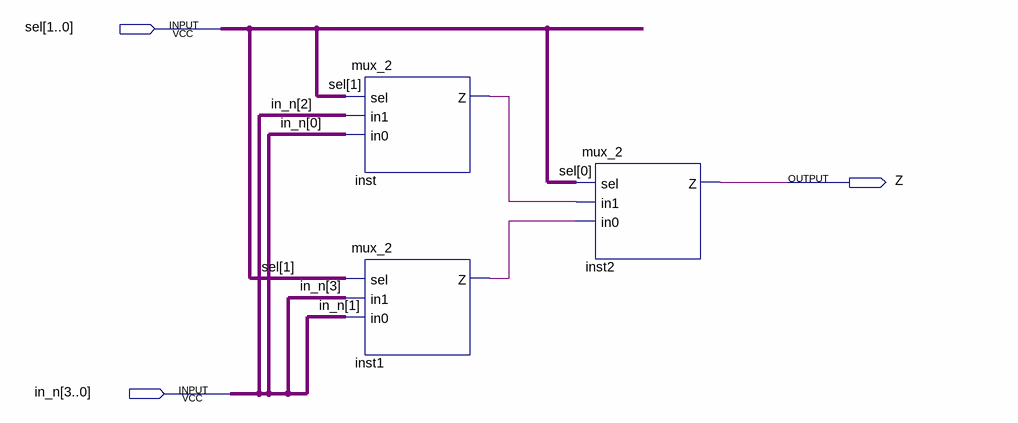
[diagram p0: schematic sheet]
// Quartus schematic mux_n.bdf as structural Verilog: 3 symbols, 3 pins
module mux_n (
  input  [1:0] sel,
  input  [3:0] in_n,
  output Z
);

  wire inst1_z, inst_z;

  mux_2 inst (.sel(sel[1]), .in1(in_n[2]), .in0(in_n[0]), .Z(inst_z));
  mux_2 inst1 (.sel(sel[1]), .in1(in_n[3]), .in0(in_n[1]), .Z(inst1_z));
  mux_2 inst2 (.sel(sel[0]), .in1(inst_z), .in0(inst1_z), .Z(Z));
endmodule
